# Altium schematic sheet 舱内通信板.SchDoc
size A4
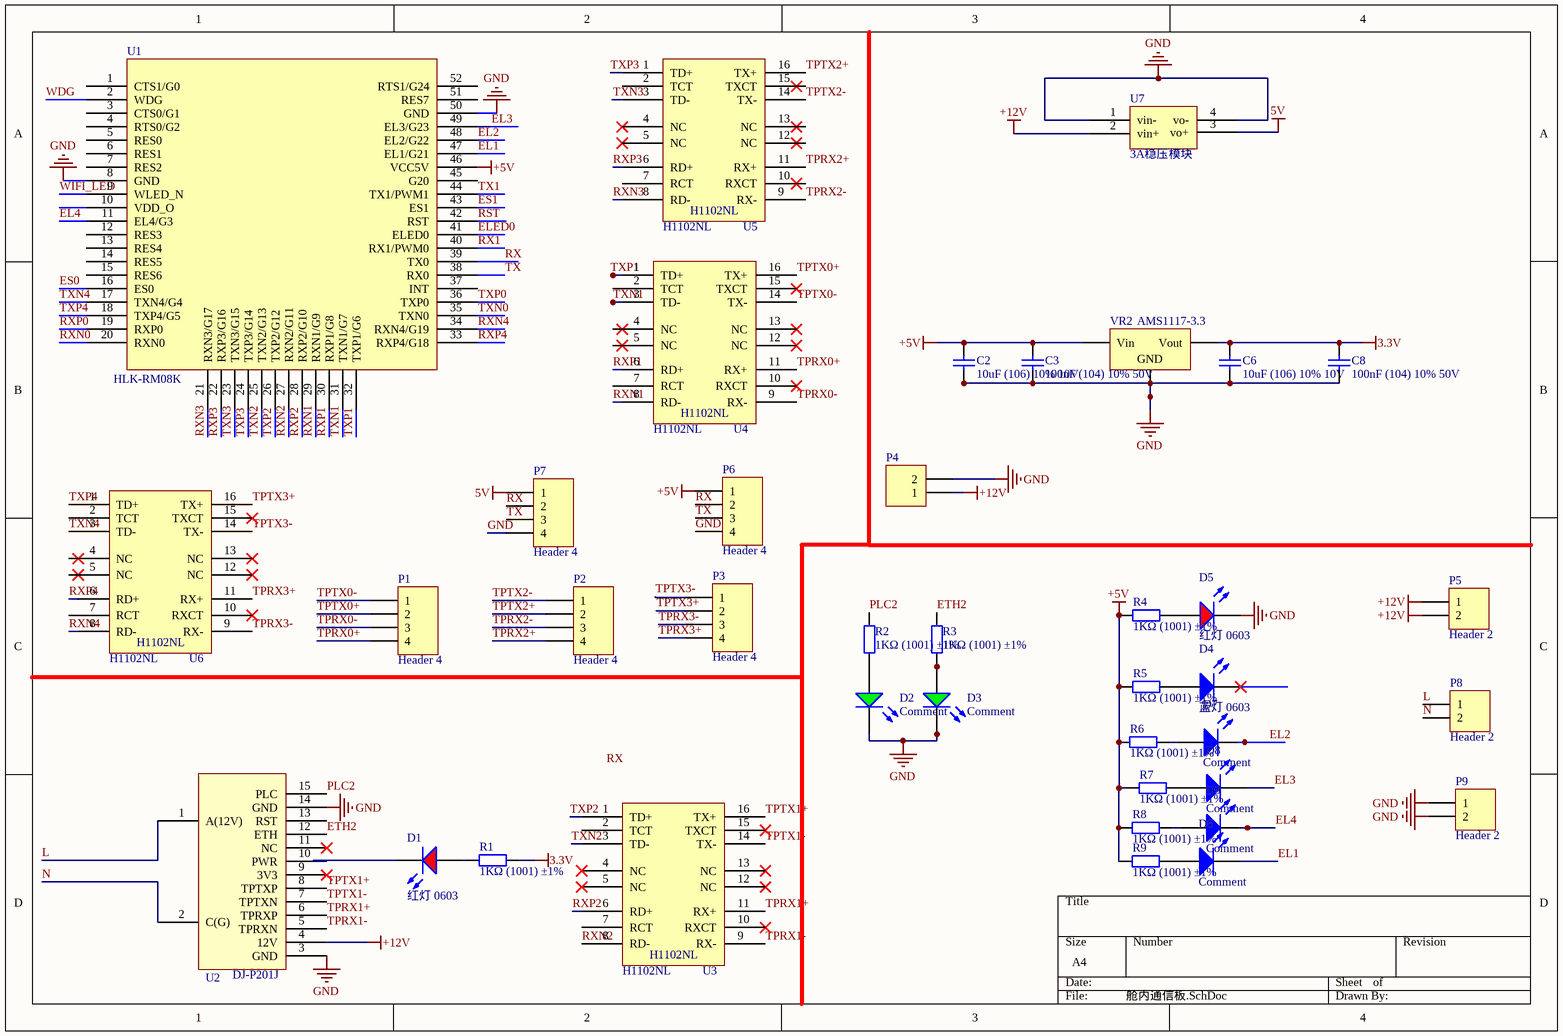
[diagram p0: 舱内通信板.SchDoc]

## Parts
C2  10uF (106) 10% 10V  [LC-0603_C]
C3  100nF (104) 10% 50V  [LC-0603_C]
C6  10uF (106) 10% 10V  [LC-0603_C]
C8  100nF (104) 10% 50V  [LC-0603_C]
D1  红灯 0603  [LC-0603_LED_S1]
D2  Comment  [LC-0603_LED_S1]
D3  Comment  [LC-0603_LED_S1]
D4  蓝灯 0603  [LC-0603_LED_S1]
D5  红灯 0603  [LC-0603_LED_S1]
D6  Comment  [LC-0603_LED_S1]
D7  Comment  [LC-0603_LED_S1]
D8  Comment  [LC-0603_LED_S1]
D9  Comment  [LC-0603_LED_S1]
P1  Header 4  [Molex-4]
P2  Header 4  [Molex-4]
P3  Header 4  [Molex-4]
P4  Header 2H  [HDR1X2]  (value not drawn)
P5  Header 2  [XT30 - 2]
P6  Header 4  [Molex-4]
P7  Header 4  [Molex-4]
P8  Header 2  [XT30 - 2]
P9  Header 2  [XT30 - 2]
R1  1KΩ (1001) ±1%  [LC-0603_R]
R2  1KΩ (1001) ±1%  [LC-0603_R]
R3  1KΩ (1001) ±1%  [LC-0603_R]
R4  1KΩ (1001) ±1%  [LC-0603_R]
R5  1KΩ (1001) ±1%  [LC-0603_R]
R6  1KΩ (1001) ±1%  [LC-0603_R]
R7  1KΩ (1001) ±1%  [LC-0603_R]
R8  1KΩ (1001) ±1%  [LC-0603_R]
R9  1KΩ (1001) ±1%  [LC-0603_R]
U1  HLK-RM08K  [RM08k]
U2  DJ-P201J  [DJ-P201J]
U3  H1102NL  [H1102NL]
U4  H1102NL  [H1102NL]
U5  H1102NL  [H1102NL]
U6  H1102NL  [H1102NL]
U7  3A稳压模块  [稳压模块]
VR2  AMS1117-3.3  [LC-SOT-223]

## Nets
3.3V: C6.2 C8.2 R1.2 VR2.2(Vout)
5V: P7.1 U7.3(vo+)
+5V: C2.2 C3.2 P6.1 R4.2 R5.2 R7.2 R8.2 R9.2 U1.46(VCC5V) VR2.3(Vin)
+12V: P4.1 P5.1 P5.2 U2.4(12V) U7.2(vin+)
GND: C2.1 C3.1 C6.1 C8.1 D2.K D3.K D5.K P4.2 P6.4 P7.4 P9.1 P9.2 U1.8(GND) U1.50(GND) U2.3(GND) U2.14(GND) U7.1(vin-) U7.4(vo-) VR2.1(GND)
EL1: D6.K U1.47(EL1/G21)
EL2: D7.K U1.48(EL2/G22)
EL3: D8.K U1.49(EL3/G23)
EL4: D9.K U1.11(EL4/G3)
ELED0: U1.41(ELED0)
ES0: U1.16(ES0)
ES1: U1.43(ES1)
ETH2: R3.2 U2.12(ETH)
L: P8.1 U2.1(A(12V))
N: P8.2 U2.2(C(G))
PLC2: R2.2 U2.15(PLC)
RST: U1.42(RST)
RX: P6.2 P7.2 U1.39(TX0)
RX1: U1.40(RX1/PWM0)
RXN0: U1.20(RXN0)
RXN1: U1.29(RXN1/G9) U4.8(RD-)
RXN2: U1.27(RXN2/G11) U3.8(RD-)
RXN3: U1.21(RXN3/G17) U5.8(RD-)
RXN4: U1.34(RXN4/G19) U6.8(RD-)
RXP0: U1.19(RXP0)
RXP1: U1.30(RXP1/G8) U4.6(RD+)
RXP2: U1.28(RXP2/G10) U3.6(RD+)
RXP3: U1.22(RXP3/G16) U5.6(RD+)
RXP4: U1.33(RXP4/G18) U6.6(RD+)
TPRX0+: P1.4 U4.11(RX+)
TPRX0-: P1.3 U4.9(RX-)
TPRX1+: U2.6(TPRXP) U3.11(RX+)
TPRX1-: U2.5(TPRXN) U3.9(RX-)
TPRX2+: P2.4 U5.11(RX+)
TPRX2-: P2.3 U5.9(RX-)
TPRX3+: P3.4 U6.11(RX+)
TPRX3-: P3.3 U6.9(RX-)
TPTX0+: P1.2 U4.16(TX+)
TPTX0-: P1.1 U4.14(TX-)
TPTX1+: U2.8(TPTXP) U3.16(TX+)
TPTX1-: U2.7(TPTXN) U3.14(TX-)
TPTX2+: P2.2 U5.16(TX+)
TPTX2-: P2.1 U5.14(TX-)
TPTX3+: P3.2 U6.16(TX+)
TPTX3-: P3.1 U6.14(TX-)
TX: P6.3 P7.3 U1.38(RX0)
TX1: U1.44(TX1/PWM1)
TXN0: U1.35(TXN0)
TXN1: U1.31(TXN1/G7) U4.3(TD-)
TXN2: U1.25(TXN2/G13) U3.3(TD-)
TXN3: U1.23(TXN3/G15) U5.3(TD-)
TXN4: U1.17(TXN4/G4) U6.3(TD-)
TXP0: U1.36(TXP0)
TXP1: U1.32(TXP1/G6) U4.1(TD+)
TXP2: U1.26(TXP2/G12) U3.1(TD+)
TXP3: U1.24(TXP3/G14) U5.1(TD+)
TXP4: U1.18(TXP4/G5) U6.1(TD+)
WDG: U1.2(WDG)
WIFI_LED: U1.9(WLED_N)
NetD1_A: D1.A R1.1
NetD1_K: D1.K U2.10(PWR)
NetD2_A: D2.A R2.1
NetD3_A: D3.A R3.1
NetD4_A: D4.A R5.1
NetD5_A: D5.A R4.1
NetD6_A: D6.A R9.1
NetD7_A: D7.A R6.1
NetD8_A: D8.A R7.1
NetD9_A: D9.A R8.1

Not connected (* = marked no-connect by the designer): D4 K*; R6 2; U1 1(CTS1/G0) 3(CTS0/G1) 4(RTS0/G2) 5(RES0) 6(RES1) 7(RES2) 10(VDD_O) 12(RES3) 13(RES4) 14(RES5) 15(RES6) 37(INT) 45(G20) 51(RES7) 52(RTS1/G24); U2 9(3V3)* 11(NC)* 13(RST); U3 2(TCT) 4(NC)* 5(NC)* 7(RCT) 10(RXCT)* 12(NC)* 13(NC)* 15(TXCT)*; U4 2(TCT) 4(NC) 5(NC) 7(RCT) 10(RXCT)* 12(NC)* 13(NC)* 15(TXCT)*; U5 2(TCT) 4(NC)* 5(NC)* 7(RCT) 10(RXCT) 12(NC) 13(NC) 15(TXCT); U6 2(TCT) 4(NC) 5(NC) 7(RCT) 10(RXCT)* 12(NC)* 13(NC)* 15(TXCT)*

## Notes on the sheet
- Labels drawn without touching a wire or pin: RX

## Library data of the parts
C2 C6 = 0603 10uF (106) 10% 10V: 贴片电容; ComponentLink1Description: 供应商链接; ComponentLink1URL: http://www.szlcsc.com/product/details_20411.html; Package: 0603; Supplier: LC; SuppliersPartNumber: C19702
C3 C8 = 0603 100nF (104) 10% 50V: 贴片电容; ComponentLink1Description: 供应商链接; ComponentLink1URL: http://www.szlcsc.com/product/details_15331.html; Package: 0603; Supplier: LC; SuppliersPartNumber: C14663
D1 D5 = 0603 红灯: 发光二极管; ComponentLink1Description: 供应商链接; ComponentLink1URL: http://www.szlcsc.com/product/details_2659.html; Package: 0603; Supplier: LC; SuppliersPartNumber: C2286
D2 D3 = 0603 绿灯: 发光二极管; ComponentLink1Description: 供应商链接; ComponentLink1URL: http://www.szlcsc.com/product/details_73152.html; Package: 0603; Supplier: LC; SuppliersPartNumber: C72043
D4 D6-D9 = 0603 蓝灯: 发光二极管; ComponentLink1Description: 供应商链接; ComponentLink1URL: http://www.szlcsc.com/product/details_73150.html; Package: 0603; Supplier: LC; SuppliersPartNumber: C72041
P1-P3 P6 P7 = Header 4: Header, 4-Pin; LatestRevisionDate: 17-Jul-2002; LatestRevisionNote: Re-released for DXP Platform.; Publisher: Altium Limited
P4 = Header 2H: Header, 2-Pin, Right Angle; LatestRevisionDate: 17-Jul-2002; LatestRevisionNote: Re-released for DXP Platform.; Publisher: Altium Limited
P5 P8 P9 = Header 2: Header, 2-Pin; LatestRevisionDate: 17-Jul-2002; LatestRevisionNote: Re-released for DXP Platform.; Publisher: Altium Limited
R1-R9 = 0603 1KΩ (1001) 1%: 贴片电阻; ComponentLink1Description: 供应商链接; ComponentLink1URL: http://www.szlcsc.com/product/details_21904.html; Package: 0603; Supplier: LC; SuppliersPartNumber: C21190
U1 = RM08K: RM08K WIFI MODEL
U2 = DJ-P201J: 电力载波
U3-U6 = H1102NL: 网口变压器
U7 = 可调稳压芯片
VR2 = SOT-223 AMS1117-3.3: 低压差线性稳压(LDO); ComponentLink1Description: 供应商链接; ComponentLink1URL: http://www.szlcsc.com/product/details_6652.html; Package: SOT-223; Supplier: LC; SuppliersPartNumber: C6186